# EAGLE design Seeed Studio Round Display for XIAO_v1.0_230308 (EAGLE 9.6.2)
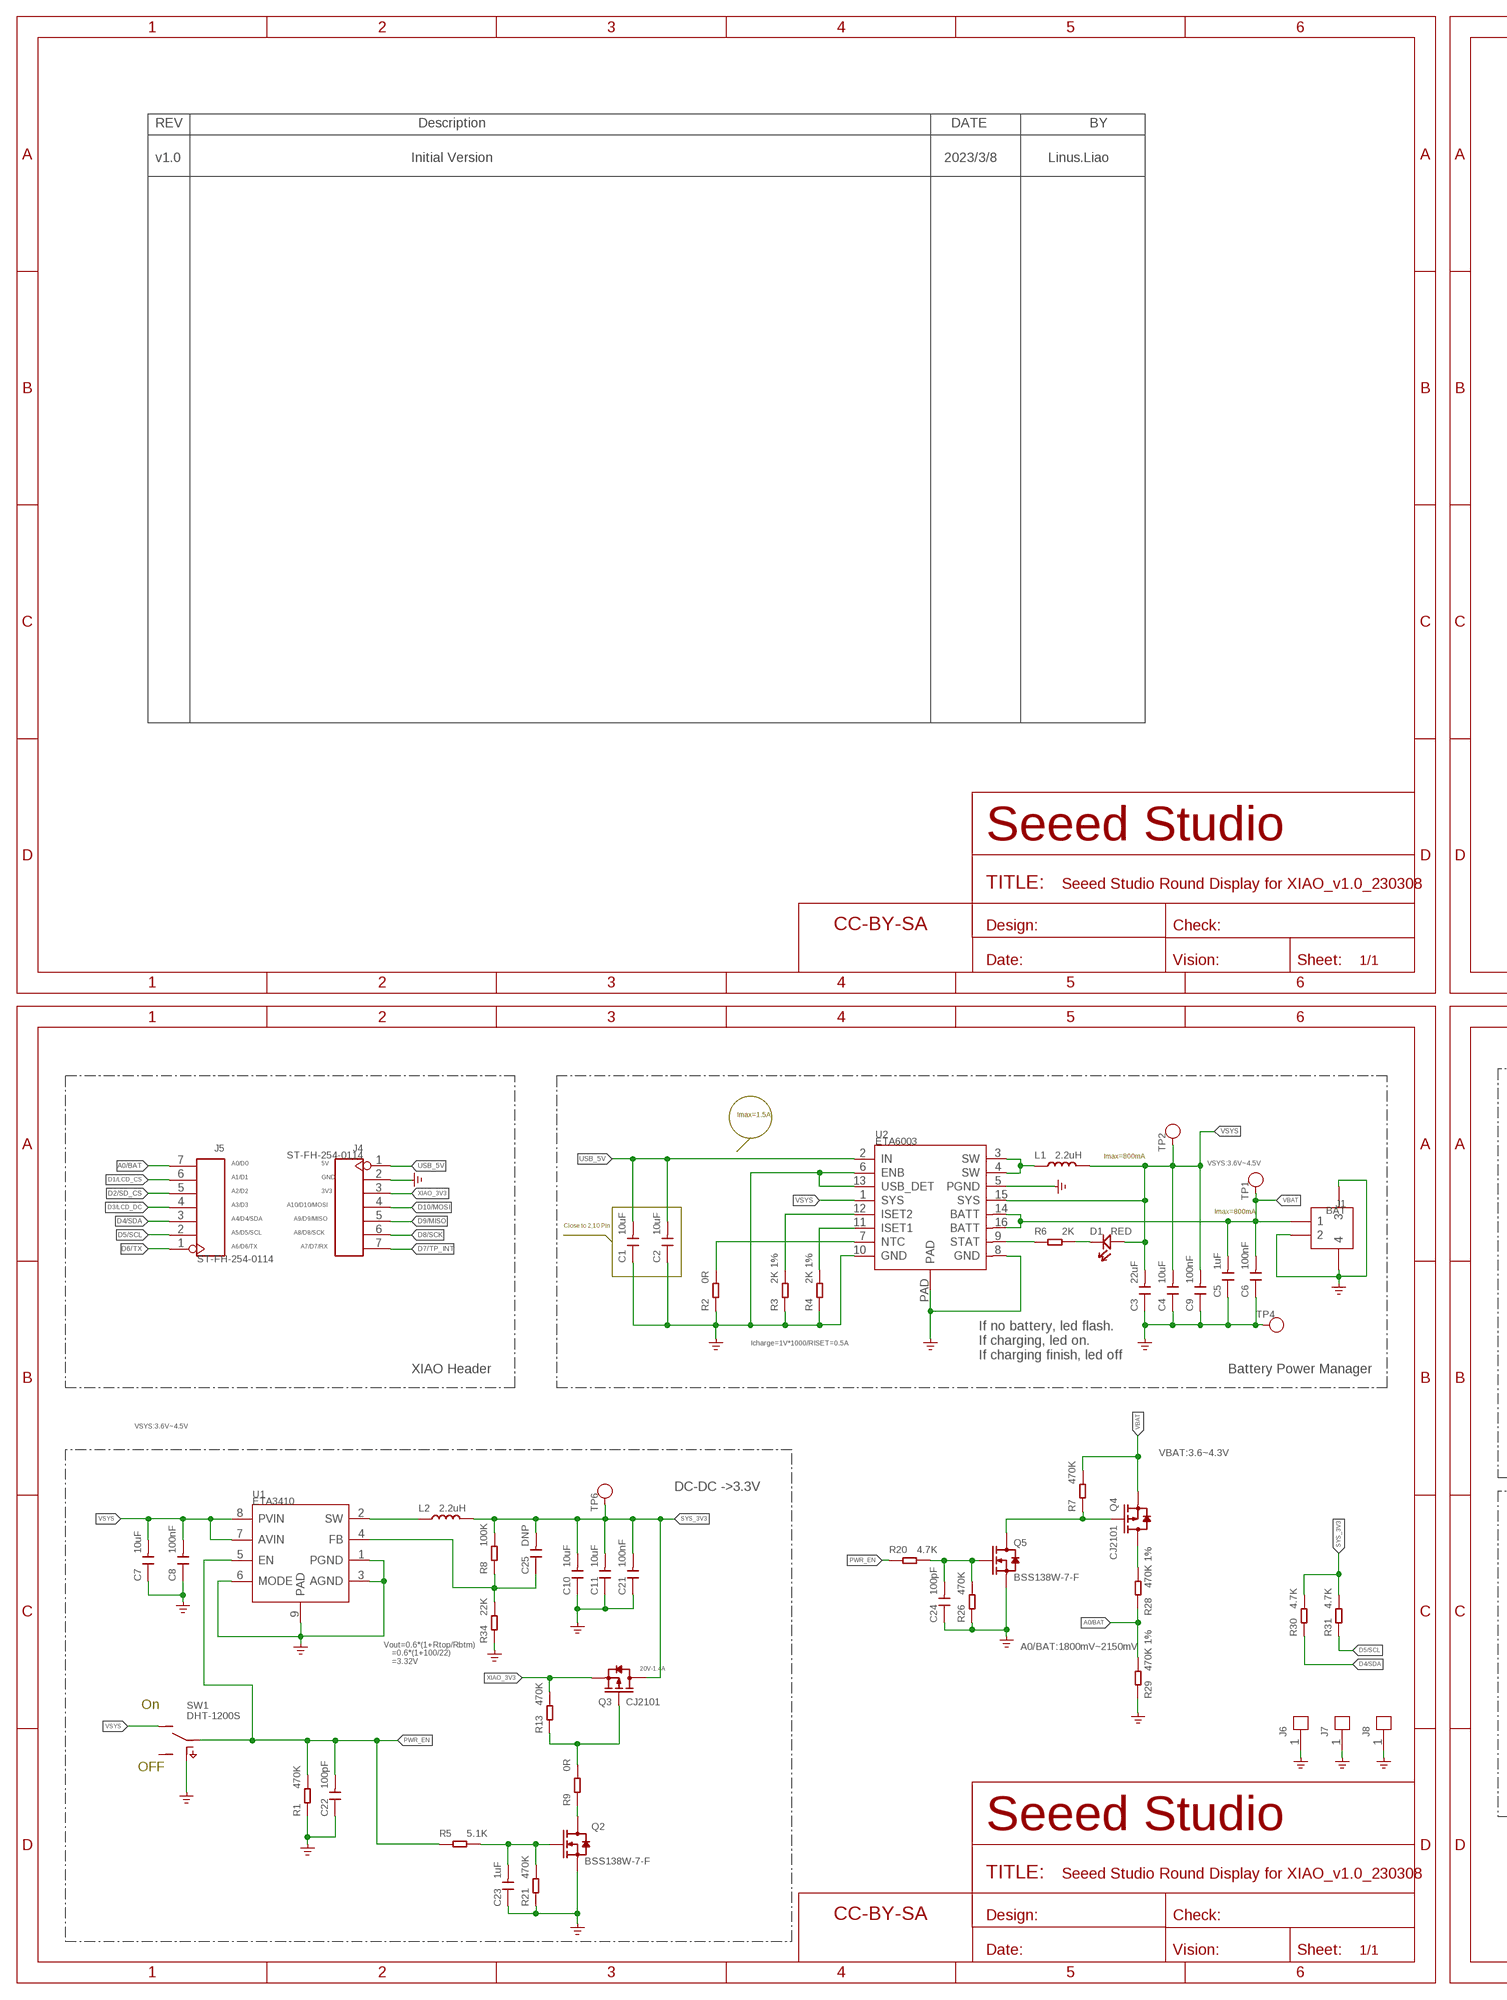
[diagram p0: schematic, sheet 1, part 1 of 2]
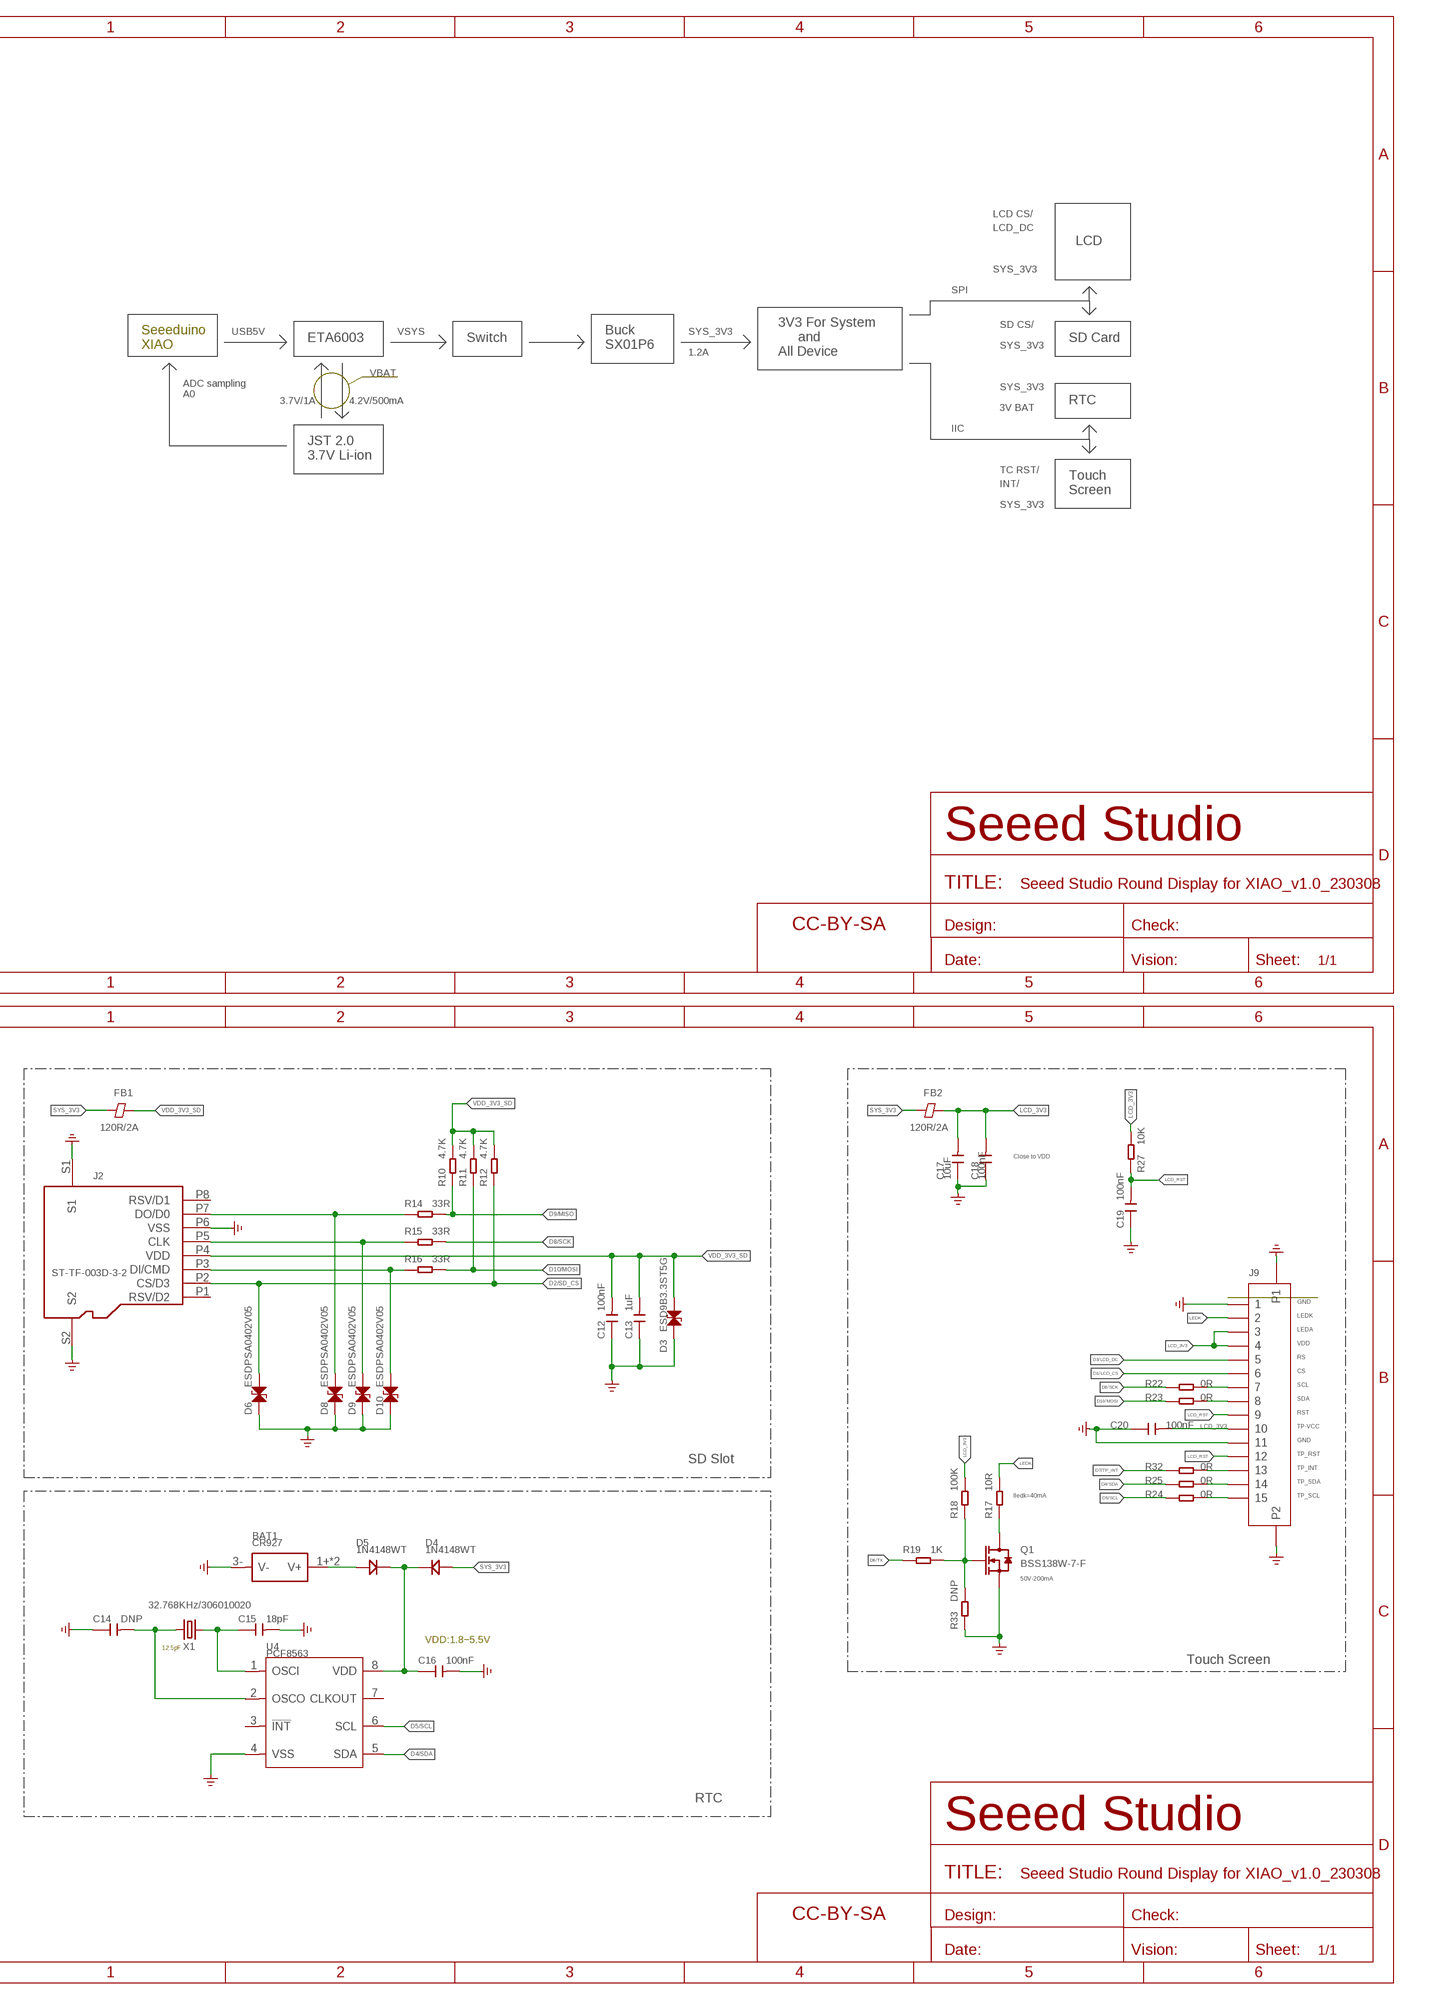
[diagram p1: schematic, sheet 1, part 2 of 2]

## Parts
BAT1  CR927  BAT-HOLDER-CR927  [BAT2P-SMD-15.3X8.6X2.9MM]
C1  10uF  CAP-0603  [C0603]
C2  10uF  CAP-0603  [C0603]
C3  22uF  CAP-0603  [C0603]
C4  10uF  CAP-0603  [C0603]
C5  1uF  CAP-0402  [C0402]
C6  100nF  CAP-0402  [C0402]
C7  10uF  CAP-0603  [C0603]
C8  100nF  CAP-0402  [C0402]
C9  100nF  CAP-0402  [C0402]
C10  10uF  CAP-0603  [C0603]
C11  10uF  CAP-0603  [C0603]
C12  100nF  CAP-0402  [C0402]
C13  1uF  CAP-0402  [C0402]
C14  DNP  CAP-0402  [C0402]
C15  18pF  CAP-0402  [C0402]
C16  100nF  CAP-0402  [C0402]
C17  10uF  CAP-0402  [C0402]
C18  100nF  CAP-0402  [C0402]
C19  100nF  CAP-0402  [C0402]
C20  100nF  CAP-0402  [C0402]
C21  100nF  CAP-0402  [C0402]
C22  100pF  CAP-0402  [C0402]
C23  1uF  CAP-0402  [C0402]
C24  100pF  CAP-0402  [C0402]
C25  DNP  CAP-0402  [C0402]
D1  RED  LED-0402  [LED-0402]
D3  ESD9B3.3ST5G  D-ESD-2P-DOUBLE-0402  [ESD-0402]
D4  1N4148WT  DIODE'0603'  [SOD-523]
D5  1N4148WT  DIODE'0603'  [SOD-523]
D6  ESDPSA0402V05  D-ESD-2P-DOUBLE-0402  [ESD-0402]
D8  ESDPSA0402V05  D-ESD-2P-DOUBLE-0402  [ESD-0402]
D9  ESDPSA0402V05  D-ESD-2P-DOUBLE-0402  [ESD-0402]
D10  ESDPSA0402V05  D-ESD-2P-DOUBLE-0402  [ESD-0402]
FB1  120R/2A  FERRITE-BEAD-0402  [F0402]
FB2  120R/2A  FERRITE-BEAD-0402  [F0402]
FR1  SEEEDSTUDIO-OPEN-SCH-FRAME  [SEEEDSTUDIO-PCB-FRAME]
FR2  SEEEDSTUDIO-OPEN-SCH-FRAME  [SEEEDSTUDIO-PCB-FRAME]
FR3  SEEEDSTUDIO-OPEN-SCH-FRAME  [SEEEDSTUDIO-PCB-FRAME]
FR4  SEEEDSTUDIO-OPEN-SCH-FRAME  [SEEEDSTUDIO-PCB-FRAME]
J1  BAT  JST-2+2P-1.25  [HW2+2P-SMD-1.25]
J2  ST-TF-003D-3-2  MICRO-SD-CARD-HOLDER-SHORT-8P  [MICRO-SD8+2P-SMD-1.1-11.41X4.9X3MM]
J4  ST-FH-254-0114  HEADER-7P-18.28X2.5  [H7-2.54-18.28X2.5X5MM]
J5  ST-FH-254-0114  HEADER-7P-18.28X2.5  [H7-2.54-18.28X2.5X5MM]
J6  HEADER-1P-3.5/2.2_PASTE  [H1P-3.5/2.2MM-PASTE]
J7  HEADER-1P-3.5/2.2_PASTE  [H1P-3.5/2.2MM-PASTE]
J8  HEADER-1P-3.5/2.2_PASTE  [H1P-3.5/2.2MM-PASTE]
J9  FPC-CONNECTOR-15P  [FPC15P-0.6-6.1X2.83X1MM]
L1  2.2uH  INDUCTOR'0806'  [L0806]
L2  2.2uH  INDUCTOR'0806'  [L0806]
Q1  BSS138W-7-F  MOSFET-N-SI1304BDL  [SOT-323]
Q2  BSS138W-7-F  MOSFET-N-SI1304BDL  [SOT-323]
Q3  CJ2101  MOSFET-P-SOT323  [SOT-323]
Q4  CJ2101  MOSFET-P-SOT323  [SOT-323]
Q5  BSS138W-7-F  MOSFET-N-SI1304BDL  [SOT-323]
R1  470K  RES-0402  [R0402]
R2  0R  RES-0402  [R0402]
R3  2K 1%  RES-0402  [R0402]
R4  2K 1%  RES-0402  [R0402]
R5  5.1K  RES-0402  [R0402]
R6  2K  RES-0402  [R0402]
R7  470K  RES-0402  [R0402]
R8  100K  RES-0402  [R0402]
R9  0R  RES-0402  [R0402]
R10  4.7K  RES-0402  [R0402]
R11  4.7K  RES-0402  [R0402]
R12  4.7K  RES-0402  [R0402]
R13  470K  RES-0402  [R0402]
R14  33R  RES-0402  [R0402]
R15  33R  RES-0402  [R0402]
R16  33R  RES-0402  [R0402]
R17  10R  RES-0603  [R0603]
R18  100K  RES-0402  [R0402]
R19  1K  RES-0402  [R0402]
R20  4.7K  RES-0402  [R0402]
R21  470K  RES-0402  [R0402]
R22  0R  RES-0402  [R0402]
R23  0R  RES-0402  [R0402]
R24  0R  RES-0402  [R0402]
R25  0R  RES-0402  [R0402]
R26  470K  RES-0402  [R0402]
R27  10K  RES-0402  [R0402]
R28  470K 1%  RES-0402  [R0402]
R29  470K 1%  RES-0402  [R0402]
R30  4.7K  RES-0402  [R0402]
R31  4.7K  RES-0402  [R0402]
R32  0R  RES-0402  [R0402]
R33  DNP  RES-0402  [R0402]
R34  22K  RES-0402  [R0402]
SW1  DHT-1200S  SWITCH-3+4P-311030002  [SW7-SMD-6.7X2.6X1.4MM-90D]
TP1  TEST-POINT'4545'  [TP-D45MIL]
TP2  TEST-POINT'4545'  [TP-D45MIL]
TP4  TEST-POINT'4545'  [TP-D45MIL]
TP6  TEST-POINT'4545'  [TP-D45MIL]
U1  ETA3410  PMIC-ETA3410  [DFN8G-0.5-2X2MM]
U2  ETA6003  PMIC-ETA6003-310990023  [QFN16GA-0.5-3X3MM]
U4  PCF8563  RTC-PCF8563T  [SOP8-1.27-5X3.9MM]
X1  32.768KHz/306010020  CRYSTAL-2P'NX2012SA'  [X2-SMD-L2.0X1.2X0.55MM]

## Nets
A0/BAT: J5.7 R28.1 R29.2
D1/LCD_CS: J5.6 J9.6
D2/SD_CS: D6.2 J2.P2(CS/D3) J5.5 R12.1
D3/LCD_DC: J5.4 J9.5
D4/SDA: J5.3 R25.1 R30.1 U4.5(SDA)
D5/SCL: J5.2 R24.1 R31.1 U4.6(SCL)
D6/TX: J5.1 R19.1
D7/TP_INT: J4.7 R32.1
D8/SCK: J4.6 R15.2 R22.1
D9/MISO: J4.5 R10.1 R14.2
D10/MOSI: J4.4 R11.1 R16.2 R23.1
GND: BAT1.3-(V-) C1.1 C2.1 C3.1 C4.1 C5.1 C6.1 C7.1 C8.1 C9.1 C10.1 C11.1 C12.1 C13.1 C14.1 C15.2 C16.2 C17.1 C18.1 C19.1 C20.1 C21.1 C22.1 C23.1 C24.1 D3.1 D6.1 D8.1 D9.1 D10.1 J1.2 J1.P1 J1.P2 J2.P6(VSS) J2.S1 J2.S2 J4.2 J6.1 J7.1 J8.1 J9.1 J9.11 J9.16(P1) J9.17(P2) Q1.2(S) Q2.2(S) Q5.2(S) R1.1 R2.1 R3.1 R4.1 R21.1 R26.1 R29.1 R33.1 R34.1 SW1.P1(SS2) SW1.P2(SS2) SW1.P3(SS2) SW1.P4(SS2) TP4.T U1.1(PGND) U1.3(AGND) U1.6(MODE) U1.9(PAD) U2.5(PGND) U2.6(ENB) U2.8(GND) U2.10(GND) U2.13(USB_DET) U2.PAD U4.4(VSS) ; supply symbol labelled GND_POWER
LCD_3V3: C17.2 C18.2 C20.2 FB2.2 J9.3 J9.4 J9.10 R18.2 R27.2
LCD_RST: C19.2 J9.9 J9.12 R27.1
LEDK: J9.2 R17.2
N$1: R6.1 U2.9(STAT)
N$2: J9.13 R32.2
N$3: R2.2 U2.7(NTC)
N$4: C25.1 R8.1 R34.2 U1.4(FB)
N$5: R3.2 U2.12(ISET2)
N$6: R4.2 U2.11(ISET1)
N$7: D1.- R6.2
N$8: Q4.3(D) R28.2
N$9: L1.1 U2.3(SW) U2.4(SW)
N$10: C23.2 Q2.1(G) R5.2 R21.2
N$12: L2.1 U1.2(SW)
N$13: Q4.1(G) Q5.3(D) R7.1
N$14: Q3.1(G) R9.2 R13.1
N$15: C14.2 U4.2(OSCO) X1.1
N$16: Q2.3(D) R9.1
N$17: D8.2 J2.P7(DO/D0) R14.1
N$18: D9.2 J2.P5(CLK) R15.1
N$19: D10.2 J2.P3(DI/CMD) R16.1
N$20: C15.1 U4.1(OSCI) X1.2
N$21: Q1.1(G) R18.1 R19.2 R33.2
N$22: J9.7 R22.2
N$23: Q1.3(D) R17.1
N$24: C16.1 D4.- D5.- U4.8(VDD)
N$25: J9.8 R23.2
N$26: BAT1.1+(V+) BAT1.2+(V+) D5.+
N$27: C24.2 Q5.1(G) R20.2 R26.2
N$32: J9.14 R25.2
N$33: J9.15 R24.2
PWR_EN: C22.2 R1.2 R5.1 R20.1 SW1.2(COM) U1.5(EN)
SYS_3V3: C10.2 C11.2 C21.2 C25.2 D4.+ FB1.1 FB2.1 L2.2 Q3.3(D) R8.2 R30.2 R31.2 TP6.T
USB_5V: C1.2 C2.2 J4.1 U2.2(IN)
VBAT: C5.2 C6.2 J1.1 Q4.2(S) R7.2 TP1.T U2.14(BATT) U2.16(BATT)
VDD_3V3_SD: C12.2 C13.2 D3.2 FB1.2 J2.P4(VDD) R10.2 R11.2 R12.2
VSYS: C3.2 C4.2 C7.2 C8.2 C9.2 D1.+ L1.2 SW1.1(A) TP2.T U1.7(AVIN) U1.8(PVIN) U2.1(SYS) U2.15(SYS)
XIAO_3V3: J4.3 Q3.2(S) R13.2
Unconnected: J2.P1(RSV/D2) J2.P8(RSV/D1) SW1.3(B) U4.3(!INT) U4.7(CLKOUT)

## Notes on the sheet
- v1.0 | Initial Version | 2023/3/8 | Linus.Liao
- LCD CS/
- LCD_DC
- LCD
- SYS_3V3
- SPI
- SD CS/
- USB5V | VSYS | SYS_3V3
- ETA6003 | Switch | SD Card
- Seeeduino
  XIAO
- Buck
  SX01P6
- SYS_3V3
- 1.2A
- 3V3 For System
       and
  All Device
- VBAT
- SYS_3V3
- ADC sampling
  A0
- 3.7V/1A | 4.2V/500mA | RTC
- 3V BAT
- IIC
- JST 2.0
  3.7V Li-ion
- TC RST/
- INT/
- Touch
  Screen
- SYS_3V3
- Imax=1.5A
- Imax=800mA | Close to VDD
- A0/D0 | 5V | VSYS:3.6V~4.5V
- A1/D1 | GND
- A2/D2 | 3V3
- A3/D3 | A10/D10/MOSI
- Imax=800mA
- A4/D4/SDA | A9/D9/MISO
- Close to 2,10 Pin
- A5/D5/SCL | A8/D8/SCK
- A6/D6/TX | A7/D7/RX
- GND
- LEDK
- LEDA
- Icharge=1V*1000/RISET=0.5A | VDD
- If no battery, led flash.
  If charging, led on.
  If charging finish, led off
- RS
- XIAO Header | Battery Power Manager | CS
- SCL
- SDA
- RST
- VSYS:3.6V~4.5V | TP-VCC
- GND
- VBAT:3.6~4.3V | TP_RST
- SD Slot
- TP_INT
- TP_SDA
- DC-DC ->3.3V
- Iledk=40mA | TP_SCL
- 50V-200mA
- VDD:1.8~5.5V
- A0/BAT:1800mV~2150mV | 12.5pF
- Vout=0.6*(1+Rtop/Rbtm)
      =0.6*(1+100/22)
      =3.32V
- Touch Screen
- 20V-1.4A
- On
- OFF
- RTC

## Library data of the parts
BAT1 = Connector-new:BAT-HOLDER: BAT2P-13.5-CR1220:320170002;BAT2P-SMD-20.5-CR1632:320170007;METAL-CR2032-D20.0*H6.3MM:320170003;METAL-CR2032-SMD:320170006;PLASTIC-CR1220-L15.06*W13.0*H4.1MM:320170000;PLASTIC-CR2032-L25.2*W15.6*H5.2MM:320170005;BAT2P-11.55-D12.55-CR1220:313010022
C1-C25 = Discrete-new:CAP: Ceramic Capacitors
D1 = Discrete-new:LED
D3 D6 D8-D10 = Discrete-new:D-ESD-2P-DOUBLE
D4 D5 = Discrete-new:DIODE
FB1 FB2 = Discrete-new:FERRITE-BEAD
FR1-FR4 = moudle-new:SEEEDSTUDIO-OPEN-SCH-FRAME
J1 = Connector-new:JST-2+2P
J2 = Connector-new:MICRO-SD-CARD-HOLDER-SHORT-8P
J4 J5 = Connector-new:HEADER-7P
J6-J8 = Connector-new:HEADER-1P
J9 = Connector-new:FPC-CONNECTOR-15P
L1 L2 = Discrete-new:INDUCTOR
Q1 Q2 Q5 = Discrete-new:MOSFET-N: IRLL014: http://www.vishay.com/docs/91319/sihll014.pdf
Q3 Q4 = Discrete-new:MOSFET-P
R1-R34 = Discrete-new:RES
SW1 = Switch:SWITCH-3+4P
TP1 TP2 TP4 TP6 = Discrete-new:TEST-POINT; PARTNO: DNP
U1 = PMIC:PMIC-ETA3410: 3MHZ 2A High Step-Down Converter in DFN2x2-8L Package
U2 = PMIC:PMIC-ETA6003
U4 = IC-new:RTC-PCF8563T
X1 = Discrete-new:CRYSTAL-2P

## Board
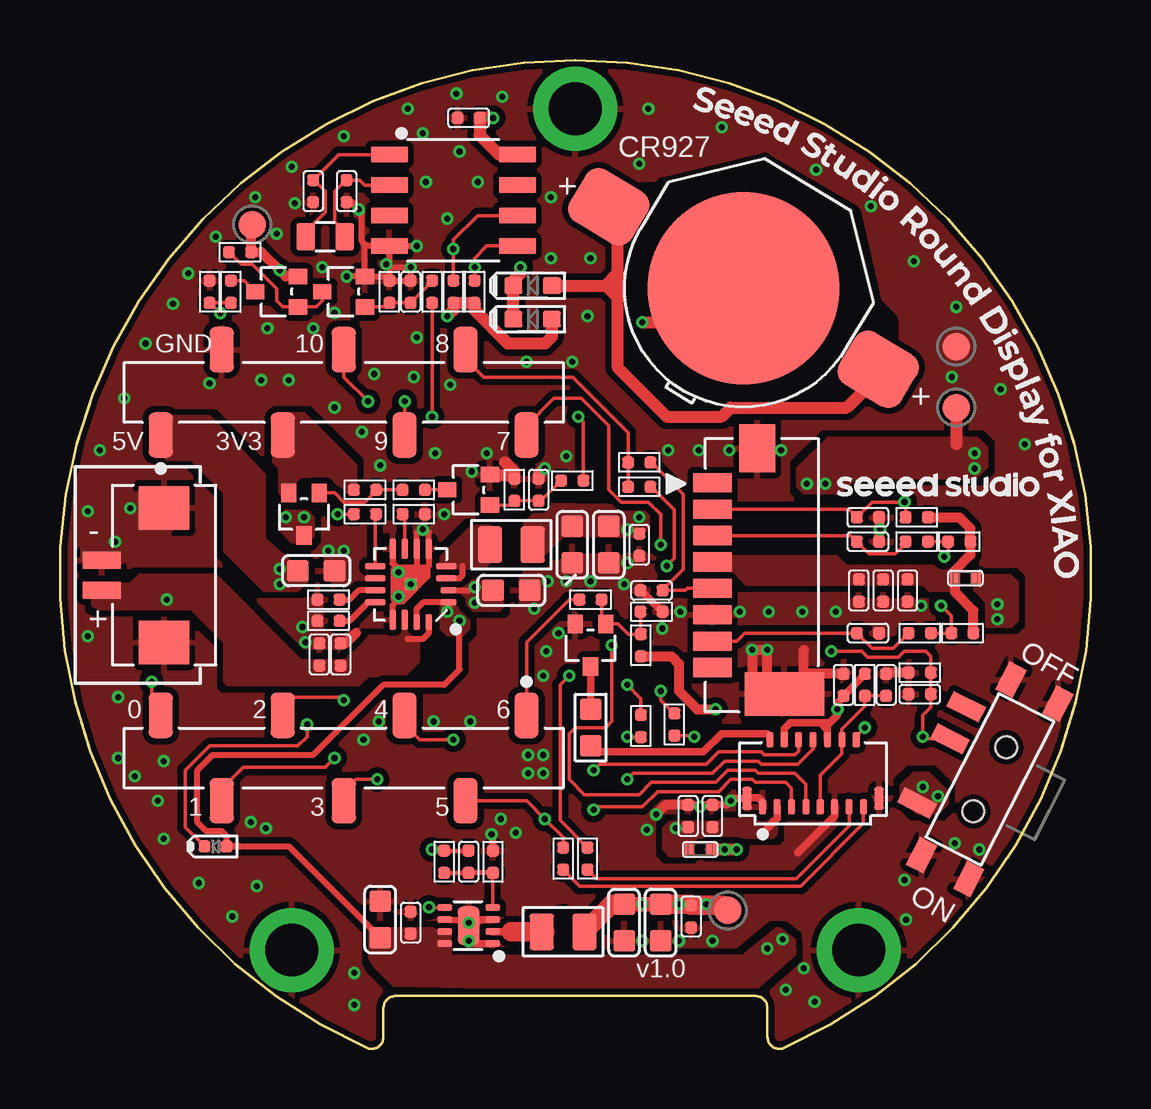
[diagram p2: board, top side]
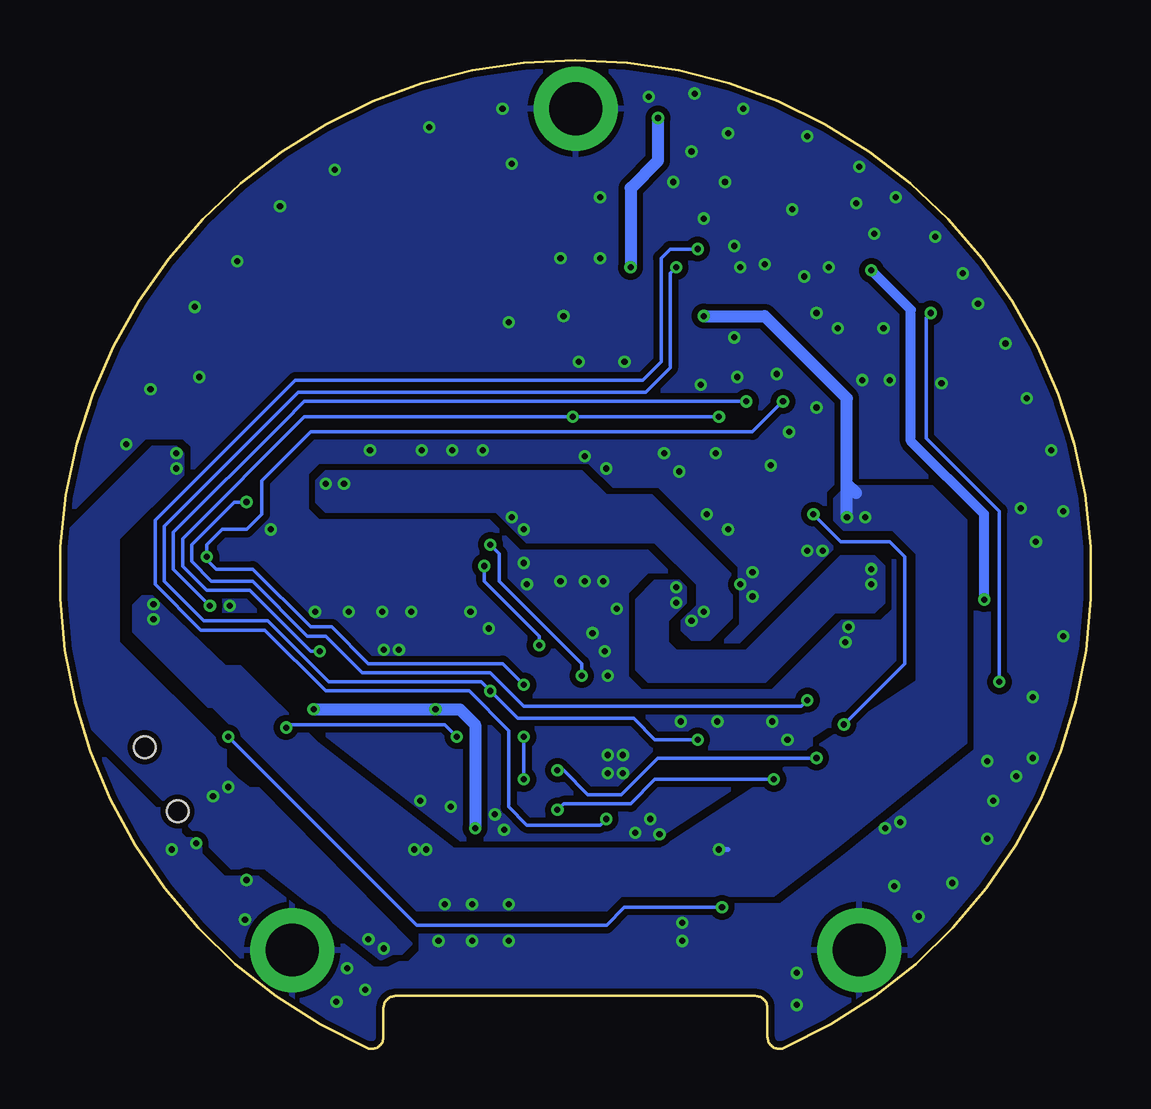
[diagram p3: board, bottom side, seen from below]

Size 42.96 x 41.2 mm. Coordinates in mm from the lower left corner, seen from the top.
Outline: 12.78,0.04 arc114 13.48,0.5 13.48,1.7 arc-90 13.98,2.2 28.98,2.2 arc-90 29.48,1.7 29.48,0.5 arc114 30.18,0.04 arc312 12.78,0.04
Copper layers (1*16): Top 0.035mm / dielectric 1.5mm / Bottom 0.035mm
Design rules "SeeedStudio_2layer_DRU_no_angle_20140221 *": minimum track width 1mil, minimum drill 10mil, track to track 5mil, track to pad 5mil, pad to pad 5mil, via to via 5mil, smd to smd 0mil, copper to edge 10mil, drill to drill 10mil, minimum pad ring 4mil, minimum via ring 4mil, stop-mask expansion 2mil, vias tented up to drill 25mil, thermal gap 10mil
tRestrict: area 18.5,20.1 to 19.1,22; area 23.9,26.6 to 34.4,35.6; area 25.2,30.8 to 33.9,37; area 15,20.6 to 15.2,21; area 20.8,4.1 to 21.1,5.8

### Footprints (pad centres in the part's own frame; a part is rotated, then mirrored left to right if it is on the bottom)
BAT2P-SMD-15.3X8.6X2.9MM = smd 3 x 2.5: 1+ -6.55,0; 2+ 6.55,0 | smd 8 x 8: 3- 0,0
C0603 = smd 0.889 x 0.889: 1 -0.762,0; 2 0.762,0
C0402 = smd 0.5 x 0.5: 1 -0.463,0; 2 0.463,0
LED-0402 = smd 0.5 x 0.5: + 0.463,0; - -0.463,0
ESD-0402 = smd 0.5 x 0.5: 1 -0.463,0; 2 0.463,0
SOD-523 = smd 0.762 x 0.7: + 0.8,0; - -0.8,0
F0402 = smd 0.445 x 0.508: 1 -0.445,0; 2 0.445,0
HW2+2P-SMD-1.25 = smd 0.7 x 1.6: 1 -0.625,0; 2 0.625,0 | smd 1.82 x 2.1: P1 -2.8,-2.6; P2 2.8,-2.6
MICRO-SD8+2P-SMD-1.1-11.41X4.9X3MM = smd 1.6 x 0.8: P1 0,3.85; P2 0,2.75; P3 0,1.65; P4 0,0.55; P5 0,-0.55; P6 0,-1.65; P7 0,-2.75; P8 0,-3.85 | smd 1.5 x 2: S1 1.86,5.28 | smd 3.3 x 1.8: S2 3,-4.95
H7-2.54-18.28X2.5X5MM = smd 1.02 x 1.9: 1 -7.62,-1.78; 2 -5.08,1.78; 3 -2.54,-1.78; 4 0,1.78; 5 2.54,-1.78; 6 5.08,1.78; 7 7.62,-1.78
H1P-3.5/2.2MM-PASTE = drill 2.2 pad 3.5: 1 0,0
FPC15P-0.6-6.1X2.83X1MM = smd 0.3 x 0.65: 1 -2.1,-1.4; 2 -1.8,1.4; 3 -1.5,-1.4; 4 -1.2,1.4; 5 -0.9,-1.4; 6 -0.6,1.4; 7 -0.3,-1.4; 8 0,1.4; 9 0.3,-1.4; 10 0.6,1.4; 11 0.9,-1.4; 12 1.2,1.4; 13 1.5,-1.4; 14 1.8,1.4; 15 2.1,-1.4 | smd 0.4 x 0.95: 16 -2.75,-1.05; 17 2.75,-1.05
L0806 = smd 1.016 x 1.524: 1 -0.889,0; 2 0.889,0
SOT-323 = smd 0.762 x 0.635: 1 0.889,-0.635; 2 0.889,0.635; 3 -0.889,0
R0402 = smd 0.5 x 0.5: 1 -0.463,0; 2 0.463,0
R0603 = smd 0.889 x 0.889: 1 -0.762,0; 2 0.762,0
SW7-SMD-6.7X2.6X1.4MM-90D = smd 0.7 x 1.5: 1 -2.25,2.25; 2 0.75,2.25; 3 2.25,2.25 | smd 1.3 x 0.8: P1 -4.1,1.1; P2 -4.1,-1.1; P3 4.1,-1.1; P4 4.1,1.1 | hole 0.9: -1.5,0; 1.5,0
TP-D45MIL = smd 1.143 x 1.143: T 0,0
DFN8G-0.5-2X2MM = smd 0.3 x 0.6: 1 -0.75,-1; 2 -0.25,-1; 3 0.25,-1; 4 0.75,-1; 5 0.75,1; 6 0.25,1; 7 -0.25,1; 8 -0.75,1 | smd 1.6 x 0.9: 9 0,0
QFN16GA-0.5-3X3MM = smd 0.28 x 0.65: 1 -0.75,-1.575; 2 -0.25,-1.575 | smd 0.28 x 0.85: 3 0.25,-1.475; 4 0.75,-1.475; 9 0.75,1.475; 10 0.25,1.475; 11 -0.25,1.475; 12 -0.75,1.475 | smd 0.85 x 0.28: 5 1.475,-0.75; 6 1.475,-0.25; 7 1.475,0.25; 8 1.475,0.75; 13 -1.475,0.75; 14 -1.475,0.25 | smd 0.65 x 0.28: 15 -1.575,-0.25; 16 -1.575,-0.75 | smd 0.508 x 0.508: PAD 0,0
SOP8-1.27-5X3.9MM = smd 0.635 x 1.524: 1 -1.905,-2.667; 2 -0.635,-2.667; 3 0.635,-2.667; 4 1.905,-2.667; 5 1.905,2.667; 6 0.635,2.667; 7 -0.635,2.667; 8 -1.905,2.667
X2-SMD-L2.0X1.2X0.55MM = smd 0.762 x 1.143: 1 -0.813,0; 2 0.813,0

### Placement (x,y rotation side)
BAT1  28.48,31.7 148.9 top
C1  18.8,19.1 180 top
C2  10.68,19.93 180 top
C3  21.34,21.01 90 top
C4  22.87,21.01 90 top
C5  11.69,16.44 270 top
C6  10.8,16.44 270 top
C7  13.34,5.39 270 top
C8  14.61,5.26 270 top
C9  24.14,21.01 90 top
C10  25.03,5.26 90 top
C11  23.5,5.26 90 top
C12  34.3,19.1 90 top
C13  35.31,19.1 90 top
C14  11.95,35.74 90 top
C15  10.55,35.74 270 top
C16  17.03,38.79 180 top
C17  27.19,9.7 270 top
C18  26.17,9.7 270 top
C19  34.42,15.17 270 top
C20  32.65,15.17 270 top
C21  26.3,5.51 90 top
C22  35.82,14.78 0 top
C23  19.95,23.29 270 top
C24  14.61,31.55 270 top
C25  17.03,7.8 90 top
D1  6.48,8.43 0 top
D3  33.28,19.1 90 top
D4  19.69,30.41 0 top
D5  19.69,31.8 0 top
D6  33.66,22.15 180 top
D8  33.66,17.32 180 top
D9  24.65,19.1 0 top
D10  33.66,21.13 180 top
FB1  37.73,19.61 180 top
FB2  26.68,8.31 180 top
FR1  -2.71,-32.29 0 top  (outside the outline)
FR2  -2.71,-24.67 0 top  (outside the outline)
FR3  -2.71,-17.05 0 top  (outside the outline)
FR4  -2.71,-9.43 0 top  (outside the outline)
J1  1.74,19.74 90 top
J2  27.19,19.74 0 top
J4  11.82,27.36 0 top
J5  11.82,12.12 180 top
J6  33.28,4.12 0 top
J7  9.66,4.12 0 top
J8  21.47,39.17 0 top
J9  31.38,11.48 0 top
L1  18.8,21.01 0 top
L2  20.96,4.88 0 top
Q1  22.11,16.82 90 top
Q2  17.03,23.29 0 top
Q3  10.17,22.28 90 top
Q4  9.02,31.55 0 top
Q5  11.82,31.55 0 top
R1  35.82,15.67 0 top
R2  14.74,22.28 180 top
R3  11.18,17.83 0 top
R4  11.18,18.72 0 top
R5  21.34,23.67 180 top
R6  12.71,22.28 180 top
R7  7.5,33.2 0 top
R8  16.01,7.8 90 top
R9  14.74,23.29 180 top
R10  37.6,17.32 0 top
R11  37.47,21.13 0 top
R12  35.69,22.15 0 top
R13  12.71,23.29 180 top
R14  35.82,17.32 0 top
R15  24.14,24.44 180 top
R16  35.69,21.13 0 top
R17  22.11,13.39 270 top
R18  24.2,16.82 270 top
R19  22.11,18.72 0 top
R20  15.5,31.55 90 top
R21  18.93,23.29 270 top
R22  24.14,23.42 0 top
R23  24.2,13.45 270 top
R24  20.96,7.93 270 top
R25  25.6,13.51 270 top
R26  13.72,31.55 270 top
R27  33.54,15.17 90 top
R28  7.12,31.55 90 top
R29  6.23,31.55 270 top
R30  17.28,31.55 270 top
R31  16.39,31.55 270 top
R32  21.98,7.93 270 top
R33  24.65,18.21 180 top
R34  18.04,7.8 270 top
SW1  38.74,11.23 63 top
TP1  8.01,34.34 270 top
TP2  37.35,26.72 90 top
TP4  37.35,29.26 90 top
TP6  27.82,5.77 180 top
U1  17.03,5.13 90 top
U2  14.61,19.36 90 top
U4  16.39,35.36 270 top
U$1  [LOGO-SEEED-NEW-0.94X8.4MM]  32.39,23.04 0 top
X1  11.06,33.83 180 top

### Tracks (layer width: path | path; a pad name or v marks a point on that pad's centre or on a via)
A0/BAT  (via drill 0.25 pad 0.51)
  Top 0.152: J5.7 4.2,14.4 3.82,14.78 v3.82,15.29 | R28.1 R29.2 6.25,31.09 v6.67,30.66
  Bottom 0.152: v3.82,15.29 3.82,22.4 6.87,25.45 6.87,30.47 v6.67,30.66
D1/LCD_CS  (via drill 0.25 pad 0.51)
  Top 0.152: J5.6 6.74,10.85 7.63,11.74 11.06,11.74 v11.44,12.12 | J9.6 30.78,12.41 30.61,12.24 29.34,12.24 29.22,12.37 27.44,12.37 26.93,11.86 22.49,11.86 v22.23,11.61
  Bottom 0.152: v11.44,12.12 18.04,12.12 19.57,10.59 20.96,10.59 21.98,11.61 v22.23,11.61
D2/SD_CS  (via drill 0.25 pad 0.51)
  Top 0.152: J5.5 9.28,14.15 9.79,14.66 11.69,14.66 v11.82,14.53 | J2.P2 32.86,22.49 D6.2 33.83,22.79 v35.19,22.79 35.23,22.74 R12.1
  Bottom 0.152: v35.19,22.79 35.69,22.79 37.47,21.01 37.47,20.31 36.65,19.48 34.93,19.48 32.65,17.2 31.88,17.2 30.36,15.67 25.03,15.67 23.63,14.28 12.07,14.28 v11.82,14.53
D3/LCD_DC  (via drill 0.25 pad 0.51)
  Top 0.152: J5.4 11.82,10.72 12.33,11.23 v13.22,11.23 | J9.5 30.48,10.86 30.23,11.1 28.96,11.1 28.84,11.23 27.95,11.23 27.44,10.72 24.9,10.72 24.26,10.09 22.36,10.09 v22.23,9.96
  Bottom 0.152: v13.22,11.23 18.17,11.23 19.18,10.21 21.98,10.21 v22.23,9.96
D4/SDA  (via drill 0.25 pad 0.51)
  Top 0.152: J5.3 14.36,13.51 14.99,12.88 v16.39,12.88 | U4.5 17.79,33.45 17.28,32.95 v17.28,32.56 R30.1 | R25.1 25.58,13.98 25.03,14.53 v25.03,14.91
  Bottom 0.152: v17.28,32.56 17.53,32.31 17.53,28.37 18.55,27.36 33.03,27.36 38.62,21.77 38.62,19.48 36.96,17.83 34.3,17.83 31.76,15.29 25.41,15.29 v25.03,14.91 23.88,13.77 19.06,13.77 18.17,12.88 v16.39,12.88
D5/SCL  (via drill 0.25 pad 0.51)
  Top 0.152: R31.1 v16.39,33.33 16.39,33.71 17.41,34.72 U4.6 | J5.2 19.44,10.34 v20.2,9.58 20.96,8.82 R24.1
  Bottom 0.152: v16.39,33.33 17.53,33.33 17.91,32.95 17.91,28.63 18.68,27.87 33.15,27.87 39,22.02 39,19.36 37.09,17.45 34.42,17.45 31.88,14.91 25.92,14.91 24.26,13.26 24.26,10.09 23.5,9.32 20.45,9.32 v20.2,9.58
D6/TX
  Top 0.152: R19.1 21.22,18.72 19.44,16.94 J5.1
D7/TP_INT  (via drill 0.25 pad 0.51)
  Top 0.152: J4.7 19.44,25.96 20.58,27.1 21.72,27.1 22.87,25.96 22.87,23.29 23.38,22.79 24.52,22.79 25.03,22.28 v25.03,21.01 | v21.22,15.55 20.84,15.17 20.84,9.53 R32.1
  Bottom 0.152: v25.03,21.01 24.65,20.63 24.65,19.48 21.22,16.05 v21.22,15.55
D8/SCK
  Top 0.152: R22.1 R15.2 23.67,25.68 21.36,27.99 17.66,27.99 16.9,28.75 J4.6
D9/MISO  (via drill 0.25 pad 0.51)
  Top 0.152: R14.2 R10.1 37.14,18.04 v36.71,18.47 | J4.5 v14.36,26.98
  Bottom 0.152: v36.71,18.47 38.23,19.99 38.23,21.52 33.73,26.02 33.66,26.09 32.77,26.98 v14.36,26.98
D10/MOSI  (via drill 0.25 pad 0.51)
  Top 0.152: R16.2 R11.1 37.01,20.67 v36.84,20.5 | J4.4 11.82,27.99 v12.83,26.98 | R23.1 24.2,14.59 v23.63,15.17
  Bottom 0.152: v12.83,26.98 14.1,25.71 32.52,25.71 34.55,23.67 34.55,22.28 35.19,21.64 36.2,21.64 36.84,21.01 v36.84,20.5 36.84,20.37 36.46,19.99 34.93,19.99 32.52,17.58 31.63,17.58 30.11,16.05 24.52,16.05 v23.63,15.17
GND  (via drill 0.25 pad 0.51)
  Top 0.254: 14.86,20 U2.6 14.86,21.51 14.87,21.52 | 14.86,20 14.87,19.99 | U2.8 13.86,20.23 14.1,19.99 v14.1,19.86 | U2.13 13.86,18.48 14.1,18.72 v14.1,18.85 | 14.86,20 14.86,19.61 U2.PAD | U4.4 12.77,33.45 12.58,33.64 12.58,34.85 v12.45,34.98 12.15,35.28 C14.1 | Q5.2 v11.95,32.18 | Q5.2 13.55,32.18 R26.1 C24.1 v14.61,32.56 13.72,32.56 | U4.4 v14.87,33.45 | U4.4 13.72,32.56 | 13.72,32.56 13.72,31.93 | Q5.2 12.71,33.45 | 15.37,21.52 15.36,21.5 U2.5 15.36,20.11 15.12,19.86 | U1.6 16.9,5.38 v17.03,5.26
  Top 0.305: D10.1 34.13,21.12 | J9.1 29.28,10.28 29.09,10.47 28.66,10.47 J9.16 28.04,10.43 v27.95,10.34 27.77,10.17 C17.1 26.76,10.17 v26.68,10.09 26.6,10.17 C18.1 25.3,10.17 | R33.1 25.09,18.21 24.2,19.1 D9.1 | U1.3 17.15,5.38 v17.03,5.26 | U1.1 17.27,4.38 17.03,4.62 U1.9 | J9.11 32.28,9.72 30.74,8.18 | R34.1 18.04,8.88 v17.98,8.94
  Top 0.406: D6.1 34.13,21.69 v34.17,21.64 34.13,21.6 D10.1 | C5.1 11.9,16.9 12.33,17.32 | R1.1 34.47,15.67 C19.1 | C20.1 31.04,15.63 31,15.67 31,16.63 | J2.S2 30.1,14.79 29.47,15.42 29.47,16.56 | 29.47,16.56 v29.47,16.63 | 29.09,15.17 28.84,15.42 v28.84,16.63 29.41,16.63 29.47,16.56 | C18.1 25.23,10.17 24.9,9.83
  Top 0.508: v24.26,30.28 27.06,30.28 BAT1.3- | C23.1 19.95,23.93 v20.2,24.18 | Q2.2 18.8,23.93 18.93,23.8 18.93,24.06 18.55,24.44
  other vias: 11.82,20.75 14.61,19.36 11.18,20.75 21.09,19.48 20.33,19.48 22.11,19.48 19.76,18.34 20.77,17.32 30.23,2.47 4.33,11.99 4.33,8.75 28.33,18.21 29.54,18.21 30.93,18.21 32.33,18.21 35.89,18.47 20.14,11.48 19.5,11.48 19.5,12.24 20.14,12.24 10.23,16.94 10.1,17.58 17.15,24.06 6.23,27.74 8.64,30.02 15.25,36.12 15.12,38.15 18.42,39.68 25.85,18.21 25.09,17.51 20.14,15.55 20.26,16.56 17.09,13.64 15.57,13.64 13.28,13.64 12.64,12.88 16.01,22.28 30.04,24.94 27.88,24.94 26.61,24.94 25.34,24.94 2.42,12.12 2.42,14.66 1.15,17.2 2.29,21.13 1.15,22.4 1.66,24.94 2.67,27.1 3.56,29.39 4.71,31.04 5.34,32.31 4.07,10.34 35.25,5.39 40.2,25.2 37.16,27.99 15.12,21.64 8.39,27.87 19.44,28.63 17.41,36.12 24.52,39.17 27.57,38.41 31.5,36.63 33.79,35.1 35.57,32.82 37.35,30.91 37.28,8.56 2.93,22.53 21.09,24.69 31.44,1.96 38.3,8.31 3.12,11.36 8.2,6.78 5.79,6.91 12.26,1.83 7.18,5.51 31,3.35 35.19,7.04 39.19,27.48 15.63,24.82 13.34,24.31 12.58,25.71 11.44,26.72 16.14,34.6 17.79,24.82 6.48,33.83 8.14,35.49 9.02,33.96 9.66,36.76 11.82,38.03 14.49,39.17 16.52,39.8 16.64,37.39 21.34,28.63 21.98,30.53 22.11,32.95 20.45,32.95 20.45,35.49 24.14,36.88 9.79,35.23 10.93,32.56 11.44,30.66 10.55,30.02 13.6,32.69 13.09,28.12 14.87,29.64 14.74,27.99 16.26,27.67 9.53,27.87 23.5,19.36 23.63,20.25 24.84,9.77 24.46,9.13 18.99,9.01 17.03,4.5 24.26,4.5 25.79,4.5 27.19,4.5 7.95,9.45 8.58,9.2 18.36,9.58 12.26,3.16
  pour Top (isolate 0.254, no thermals): 13.15,19.67 12.64,19.67 12.33,19.99 12.33,20.88 12.07,21.13 11.24,21.13 11.06,20.95 11.06,19.74 11.44,19.36 12.39,19.36 12.58,19.55 13.03,19.55
  pour Top (isolate 0.254, no thermals): 22.87,20.5 24.52,20.5 24.52,19.93 24.46,19.93 23.69,19.17 21.09,19.17 20.01,18.09 19.44,18.09 19.18,18.34 19.18,19.61 19.63,20.05 20.58,20.05 21.09,20.56 22.8,20.56
  pour Bottom (isolate 0.254, rank 6): -0.12,41.33 43.06,41.33 43.06,0.05 1.79,0.05 1.79,-0.58 -0.12,-0.58
  pour Top (isolate 0.254, rank 6): 43.06,41.33 43.06,0.05 -0.12,0.05 -0.12,41.33
  pour Top (isolate 0.254, rank 6, no thermals): 35.19,18.72 30.74,18.72 30.61,18.59 30.61,18.09 30.87,17.83 33.66,17.83 33.92,17.58 33.92,17.32 34.04,17.2 34.42,17.2 35.06,17.83 35.82,17.83 35.95,17.96 35.95,18.47 35.69,18.72
  pour Top (isolate 0.254, rank 6, no thermals): 11.56,16.69 10.29,16.69 9.66,17.32 9.66,18.34 9.91,18.59 10.8,18.59 10.93,18.47 10.93,17.45 11.06,17.32 12.2,17.32
  pour Top (no thermals): 2.67,20.37 3.93,20.37 arc90 4.58,21.02 4.58,21.52 5.21,22.15 5.21,22.91 4.96,23.17 1.28,23.17 0.9,22.79 0.9,20.5 1.15,20.25 2.55,20.25
LCD_3V3  (via drill 0.25 pad 0.51)
  Top 0.305: J9.10 31.98,13.48 32.07,13.58 | 32.07,13.58 32.39,13.9 v32.39,14.15 32.39,14.4 32.65,14.66 C20.2 32.65,14.72 33.54,15.61 R27.2 | J9.4 30.18,13.33 30.42,13.58 31.69,13.58 | 31.69,13.58 32.07,13.58 | 31.69,13.58 31.95,13.32 | J9.3 29.88,9.6 29.47,9.2
  Top 0.406: R18.2 25.49,16.35 25.79,16.05 25.79,14.91 26.55,14.15 v27.31,14.15
  Bottom 0.508: v32.39,14.15 v27.31,14.15 26.3,14.15 25.66,13.51 v25.66,9.2
  pour Top (isolate 0.254, no thermals): 27.44,9.45 25.41,9.45 25.15,9.2 25.15,8.31 25.41,8.05 26.17,8.05 26.36,8.24 26.36,8.62 26.55,8.82 29.73,8.82 29.85,8.94 29.85,9.45 29.73,9.58 27.57,9.58
LCD_RST
  Top 0.152: J9.9 31.68,11.4 32.58,12.3 J9.12 32.58,13.32 33.54,14.28 R27.1 C19.2
LEDK
  Top 0.305: J9.2 29.58,13.03 29.47,13.13 27.57,13.13 26.8,12.37 22.36,12.37 R17.2
N$1
  Top 0.152: U2.9 13.14,22.24 R6.1
N$2
  Top 0.152: J9.13 32.88,9.3 30.67,7.09 22.35,7.09 R32.2
N$3
  Top 0.152: U2.7 14.36,22.19 R2.2
N$4
  Top 0.152: U1.4 18.03,7.32 R34.2
  Top 0.203: R34.2 C25.1 R8.1
N$5
  Top 0.254: U2.12 12.85,18.61 12.07,17.83 R3.2
N$6
  Top 0.254: U2.11 12.46,19.11 12.07,18.72 R4.2
N$7  (via drill 0.25 pad 0.51)
  Top 0.152: R6.2 v11.56,22.28 | v10.29,13.51 10.29,13.01 9.91,12.63 6.23,12.63 5.21,11.61 5.21,9.24 D1.-
  Bottom 0.152: v11.56,22.28 10.42,21.13 8.39,21.13 7.75,20.5 7.75,16.05 v10.29,13.51
N$8
  Top 0.152: R28.2 7.67,32.01 Q4.3
N$9
  Top 0.254: U2.3 16.64,19.61 16.77,19.74 16.77,20.12
  pour Top (isolate 0.254, no thermals): 15.95,20.05 17.66,20.05 18.3,20.69 18.3,21.41 17.94,21.77 17.15,21.77 15.88,20.5 15.88,20.12
N$10
  Top 0.152: Q2.1 18.76,22.66 R21.2 C23.2 20.04,22.83 R5.2
N$12
  Top 0.305: U1.2 18.8,4.88
  Top 0.61: 18.8,4.88 L2.1 20.2,4.88
  Top 0.813: 18.8,4.88 20.2,4.88
N$13
  Top 0.152: Q5.3 10.93,31.17 10.68,30.91 Q4.1 9.28,30.91 9.02,31.17 9.02,31.68 8.01,32.69 7.55,32.69 R7.1
N$14
  Top 0.152: Q3.1 11.44,23.17 11.82,22.79 12.71,22.79 13.17,23.25 R13.1 R9.2
N$15
  Top 0.152: U4.2 12.71,35.99 12.5,36.2 C14.2 11.9,36.2 11.44,35.74 11.44,34.47 11.56,34.34 11.69,34.22 11.87,34.04 X1.1
N$16
  Top 0.152: R9.1 Q2.3
N$17
  Top 0.152: J2.P7 28.2,16.99 28.54,17.32 D8.2 | D8.2 33.2,17.28 | D8.2 33.83,16.69 34.72,16.69 R14.1
N$18
  Top 0.152: R15.1 24.65,24.44 25.98,23.1 25.98,19.99 25.11,19.12 D9.2 26.04,19.1 26.13,19.19 J2.P5
N$19
  Top 0.152: J2.P3 32.95,21.39 D10.2 33.71,20.63 34.81,20.63 35.23,21.05 R16.1
N$20
  Top 0.152: U4.1 11.61,37.26 C15.1 10.59,36.2 11.06,35.74 11.06,34.85 10.24,34.04 X1.2
N$21
  Top 0.152: R19.2 22.57,17.88 Q1.1 23.25,17.71 23.67,17.28 R18.1 24.2,18.2 R33.2
N$22  (via drill 0.25 pad 0.51)
  Top 0.152: R22.2 24.6,23.4 24.66,23.4 25.6,22.47 25.6,20.44 v25.28,20.12 | J9.7 31.08,11.02 30.61,11.48 29.09,11.48 28.96,11.61 27.82,11.61 27.31,11.1 24.65,11.1 24.14,10.59 21.85,10.59 21.22,11.23 21.22,13.13 21.47,13.39 22.74,13.39 22.99,13.64 v22.99,16.82
  Bottom 0.152: v22.99,16.82 22.99,17.2 25.28,19.48 v25.28,20.12
N$23
  Top 0.305: R17.1 Q1.3
N$24  (via drill 0.25 pad 0.51)
  Top 0.508: D4.- D5.- 18.89,32.02 19.18,32.31 v19.18,32.56 | v18.04,38.79 C16.1 17.49,38.07 18.3,37.26 U4.8
  Bottom 0.508: v18.04,38.79 18.04,37.01 19.18,35.87 v19.18,32.56
N$25  (via drill 0.25 pad 0.51)
  Top 0.152: J9.8 31.38,12.5 30.74,11.86 29.22,11.86 29.09,11.99 27.69,11.99 27.19,11.48 23.88,11.48 v23.63,11.23 | R23.2 23.65,12.99 v23.63,13.01
  Bottom 0.152: v23.63,13.01 v23.63,11.23
N$26
  Top 0.508: BAT1.1+ 34.09,28.04 32.77,26.72 27.95,26.72 27.57,26.34 25.28,26.34 23.25,28.37 23.25,31.29 | 23.25,31.29 23.25,31.8 | 23.25,31.8 23.25,32.31 | 23.25,32.31 23.25,34.7 BAT1.2+ | D5.+ 22.74,31.8 | 22.74,31.8 23.25,31.8 | 22.74,31.8 23.25,32.31 | 22.74,31.8 23.25,31.29
N$27
  Top 0.152: R20.2 15.5,31.98 C24.2 R26.2 13.55,30.91 Q5.1
N$32  (via drill 0.25 pad 0.51)
  Top 0.152: R25.2 26.38,13.05 v26.42,13.01 | J9.14 33.18,13.03 v33.54,13.39
  Bottom 0.152: v26.42,13.01 26.93,13.51 33.41,13.51 v33.54,13.39
N$33
  Top 0.152: J9.15 33.48,9.39 30.86,6.77 21.65,6.77 R24.2
PWR_EN  (via drill 0.25 pad 0.51)
  Top 0.152: R5.1 21.81,26.13 v21.6,26.34 | v15.5,26.34 R20.1 | v32.14,16.56 33.41,16.56 33.66,16.31 34.93,16.31 35.19,16.56 36.08,16.56 36.28,16.35 R1.2 C22.2 36.28,14.23 35.95,13.9 v35.95,13.01 36.04,12.92 SW1.2 | U1.5 15.39,5.88 v15.37,5.89
  Bottom 0.152: v15.5,26.34 v21.6,26.34 32.77,26.34 37.85,21.26 37.85,20.12 36.84,19.1 35.06,19.1 32.52,16.56 v32.14,16.56 | v35.95,13.01 28.09,5.15 20.19,5.15 19.44,5.89 v15.37,5.89
SYS_3V3  (via drill 0.25 pad 0.51)
  Top 0.203: C25.2 R8.2 15.55,8.26 v15.5,8.31
  Top 0.508: D4.+ 20.49,29.68 20.2,29.39 18.68,29.39 17.28,30.79 17.28,31.04 | R30.2 17.28,31.04 | 17.28,31.04 17.23,31.09 R31.2 16.39,30.79 v16.14,30.53 | FB2.1 v27.69,8.31 v28.2,8.31
  Top 0.61: C10.2 C11.2
  Top 0.813: C11.2 22.99,6.02 L2.2 | C10.2 v25.79,6.02 26.25,6.02 C21.2 27.61,5.98 TP6.T
  Bottom 0.203: v15.5,8.31 15.12,8.31
  Bottom 0.508: v10.17,22.15 10.17,23.55 | 10.17,23.55 9.79,23.17 | 10.17,23.55 10.17,27.1 13.6,30.53 v16.14,30.53
  other vias: 9.41,22.15 39.06,18.53 39.06,17.9 24.26,6.02 26.93,6.02
  pour Top (isolate 0.254, no thermals): 10.17,21.13 9.66,21.13 9.15,21.64 9.15,22.15 9.41,22.4 10.29,22.4 10.55,22.15 10.55,21.39 10.29,21.13
  pour Bottom (isolate 0.254, no thermals): 10.55,8.43 13.22,6.4 19.57,6.4 20.18,5.79 28.1,5.79 36.58,14.28 36.78,14.28 39.89,17.38 39.89,18.49 39.53,18.85 39.12,18.85 36.08,15.93 35.44,15.93 32.27,12.75 26.55,8.31 17.91,8.31 7.25,15.29 7.25,20.63 8.26,21.64 10.29,21.64 10.68,22.02 10.68,22.91 10.17,23.42 6.61,23.42 5.21,22.02 5.21,12.75
  pour Top (isolate 0.254, no thermals): 38.23,19.74 39.6,19.74 39.89,19.45 39.89,17.83 39.63,17.58 38.62,17.58 38.62,18.59 38.11,19.1 38.11,19.61
USB_5V  (via drill 0.25 pad 0.51)
  Top 0.254: U2.2 17.02,19.11 17.03,19.1
  other vias: 9.15,19.36 9.15,19.99 17.28,19.23 17.28,18.59
  pour Top (isolate 0.254, no thermals): 10.17,20.25 9.66,20.25 8.52,21.26 8.52,23.93 6.23,26.34 4.2,26.34 3.94,26.09 3.94,25.07 4.45,24.56 5.47,24.56 6.87,23.17 6.87,20.73 8.49,19.1 9.91,19.1 10.29,19.48 10.29,20.12
  pour Top (isolate 0.254, no thermals): 16.14,19.17 16.77,19.17 17.09,19.48 18.23,19.48 18.42,19.29 18.42,18.4 18.3,18.28 17.22,18.28 16.96,18.53 16.96,18.78 16.71,19.04 16.26,19.04
  pour Bottom (isolate 0.254, no thermals): 17.66,16.94 17.66,17.83 16.9,18.59 16.9,19.23 17.15,19.48 18.17,19.48 18.93,18.72 18.93,15.8 18.44,15.31 13.58,15.31 10.68,18.21 9.02,18.21 8.64,18.59 8.64,20.12 9.02,20.5 10.42,20.5 14.36,16.56 17.28,16.56
VBAT  (via drill 0.25 pad 0.51)
  Top 0.254: U2.16 15.36,17.31 15.12,17.07 14.49,17.07
  Top 0.406: Q4.2 9.41,32.18 v9.15,32.44 8.39,33.2 R7.2 7.96,34.3 TP1.T
  Bottom 0.406: v4.45,18.72 4.45,22.28 7.5,25.33 7.5,30.79 v9.15,32.44
  pour Top (isolate 0.254, no thermals): 1.36,19.36 2.93,19.36 3.31,19.74 6.48,19.74 10.04,16.18 11.89,16.18 12.9,17.2 14.15,17.2 14.3,17.34 14.3,18.09 14.36,18.15 14.42,18.09 14.42,17.45 14.61,17.26 14.8,17.26 14.93,17.13 14.93,16.13 14.34,15.54 13.72,15.55 12.83,15.55 12.46,15.17 12.33,15.17 12.33,15.17 8.64,15.17 6.99,15.17 6.87,15.29 6.87,16.94 5.47,18.34 1.66,18.34 1.36,18.48
VDD_3V3_SD
  Top 0.406: R10.2 38.06,18.26 37.28,19.04 FB1.2 37.28,19.93 37.94,20.58 R11.2 37.94,21.69 37.47,22.15 R12.2
  pour Top (isolate 0.254, no thermals): 37.47,20.12 32.77,20.12 32.39,20.5 26.93,20.5 26.8,20.37 26.8,20.18 26.93,20.05 27.88,20.05 28.58,19.36 35.95,19.36 36.2,19.1 37.09,19.1 37.22,19.23 37.22,19.36 37.47,19.61
VSYS  (via drill 0.25 pad 0.51)
  Top 0.254: U2.15 14.86,18.34 15.13,18.61 U2.1 16.19,18.26 v16.14,18.21 | v16.64,17.83 16.64,15.8 16.01,15.17 13.47,15.17 10.55,12.24 6.36,12.24 5.72,11.61 5.72,9.45 6.1,9.07 6.74,9.07 6.95,8.86 D1.+ | D1.+ 6.95,8.35 | 7.5,8.43 D1.+ | D1.+ 9.53,8.43 12.33,5.64 C7.2
  Top 0.508: TP2.T 37.35,25.2
  Top 0.61: 13.3,4.58 C7.2
  other vias: 24.14,22.15 23.63,21.64 36.58,10.53 35.95,10.91 31.88,23.55 31.12,23.55 38.11,24.82 38.11,24.18 30.11,4.56 29.47,4.18
  pour Top (isolate 0.254, no thermals): 16.07,18.53 16.01,18.66 15.88,18.53 15.88,17.51 16.14,17.26 16.77,17.26 17.03,17.51 17.03,17.83 16.58,18.28 16.58,18.34 16.26,18.53
  pour Top (isolate 0.254, no thermals): 20.96,21.39 24.13,21.33 24.52,21.72 24.52,22.29 24.18,22.63 20.17,22.69 19.31,21.84 19.31,21.13 19.57,20.63 20.2,20.63
  pour Bottom (isolate 0.254, no thermals): 16.64,17.07 17.03,17.45 17.03,17.83 16.39,18.47 16.39,19.36 18.17,21.13 23.5,21.13 24.77,22.4 31.88,22.4 32.27,22.79 32.27,23.67 31.88,24.06 21.22,24.06 20.2,23.04 18.3,23.04 14.99,19.74 14.99,17.96 15.88,17.07
  pour Top (isolate 0.254, no thermals): 20.45,2.59 28.94,2.47 30.62,3.94 30.59,4.56 29.98,5.01 29.85,5.01 28.46,3.86 16.26,3.86 16.26,5.01 12.9,5.01 12.9,3.82 13.16,3.39 13.91,2.66 19.76,2.53
  pour Bottom (isolate 0.254, no thermals): 42.93,14.66 35.82,7.55 34.42,7.55 29.6,3.74 29.09,3.99 28.71,3.99 28.33,4.37 34.68,10.85 35.06,10.85 35.57,11.23 36.08,11.74 36.08,12.5 40.52,16.94 40.52,21.26 37.85,23.93 37.85,24.82 38.11,25.07 39.12,25.07 42.93,21.26
  pour Top (isolate 0.254, no thermals): 31,23.17 32.52,23.17 33.15,23.8 38.16,23.8 38.62,24.26 38.62,25.05 38.21,25.45 32.01,25.45 30.74,24.18 30.74,23.42
  pour Top (isolate 0.254, no thermals): 35.31,10.21 35.06,10.47 35.06,10.97 35.57,11.48 36.2,11.48 36.96,10.72 36.96,10.21 36.58,9.83 35.69,9.83
XIAO_3V3
  pour Top (isolate 0.254, no thermals): 12.33,23.42 12.33,24.31 10.17,26.47 9.28,26.47 8.9,26.09 8.9,24.44 9.15,24.18 9.15,23.17 9.41,22.91 9.53,22.91 9.66,23.04 9.79,23.17 9.79,23.61 10.04,23.86 11.25,23.86 11.95,23.17 12.2,23.17 12.33,23.29

### Text on the board
tNames: CR927 | + | GND | 10 | 8 | + | 5V | 3V3 | 9 | 7 | - | + | OFF | 0 | 2 | 4 | 6 | 1 | 3 | 5 | ON | v1.0